# EAGLE design Adafruit Perma Proto Bonnet (EAGLE 6.6.0)
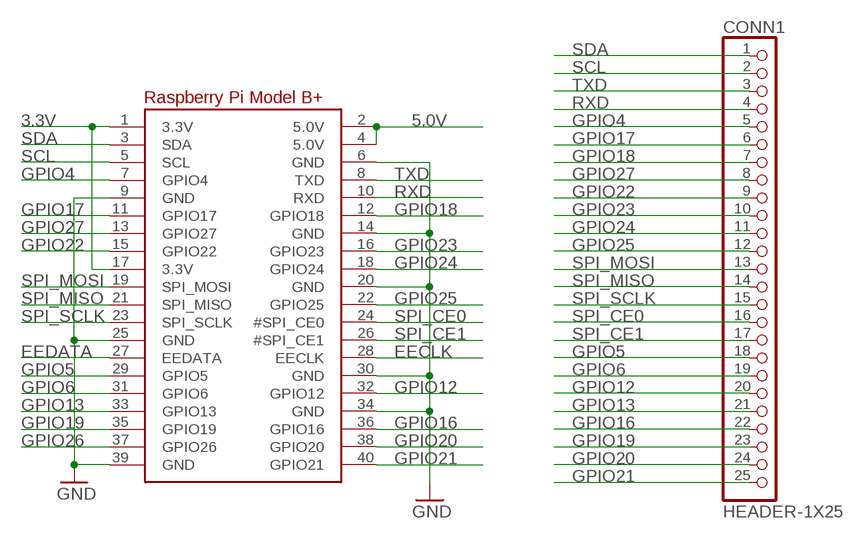
[diagram p0: schematic, sheet 1]

## Parts
CONN1  HEADER-1X25  [1X25_ROUND_70MIL]
RPI1  RASPBERRYPI_BPLUS_BONNETNODIM  [PI_BONNET_NODIM]

## Nets
3.3V: RPI1.1(3.3V) RPI1.17(3.3V)
5.0V: RPI1.2(5.0V) RPI1.4(5.0V)
EECLK: RPI1.28(EECLK)
EEDATA: RPI1.27(EEDATA)
GND: RPI1.6(GND) RPI1.9(GND) RPI1.14(GND) RPI1.20(GND) RPI1.25(GND) RPI1.30(GND) RPI1.34(GND) RPI1.39(GND)
GPIO4: CONN1.5 RPI1.7(GPIO4)
GPIO5: CONN1.18 RPI1.29(GPIO5)
GPIO6: CONN1.19 RPI1.31(GPIO6)
GPIO12: CONN1.20 RPI1.32(GPIO12)
GPIO13: CONN1.21 RPI1.33(GPIO13)
GPIO16: CONN1.22 RPI1.36(GPIO16)
GPIO17: CONN1.6 RPI1.11(GPIO17)
GPIO18: CONN1.7 RPI1.12(GPIO18)
GPIO19: CONN1.23 RPI1.35(GPIO19)
GPIO20: CONN1.24 RPI1.38(GPIO20)
GPIO21: CONN1.25 RPI1.40(GPIO21)
GPIO22: CONN1.9 RPI1.15(GPIO22)
GPIO23: CONN1.10 RPI1.16(GPIO23)
GPIO24: CONN1.11 RPI1.18(GPIO24)
GPIO25: CONN1.12 RPI1.22(GPIO25)
GPIO26: RPI1.37(GPIO26)
GPIO27: CONN1.8 RPI1.13(GPIO27)
RXD: CONN1.4 RPI1.10(RXD)
SCL: CONN1.2 RPI1.5(SCL)
SDA: CONN1.1 RPI1.3(SDA)
SPI_CE0: CONN1.16 RPI1.24(#SPI_CE0)
SPI_CE1: CONN1.17 RPI1.26(#SPI_CE1)
SPI_MISO: CONN1.14 RPI1.21(SPI_MISO)
SPI_MOSI: CONN1.13 RPI1.19(SPI_MOSI)
SPI_SCLK: CONN1.15 RPI1.23(SPI_SCLK)
TXD: CONN1.3 RPI1.8(TXD)

## Library data of the parts
CONN1 = microbuilder:HEADER-1X25
RPI1 = microbuilder:RASPBERRYPI_BPLUS

## Board
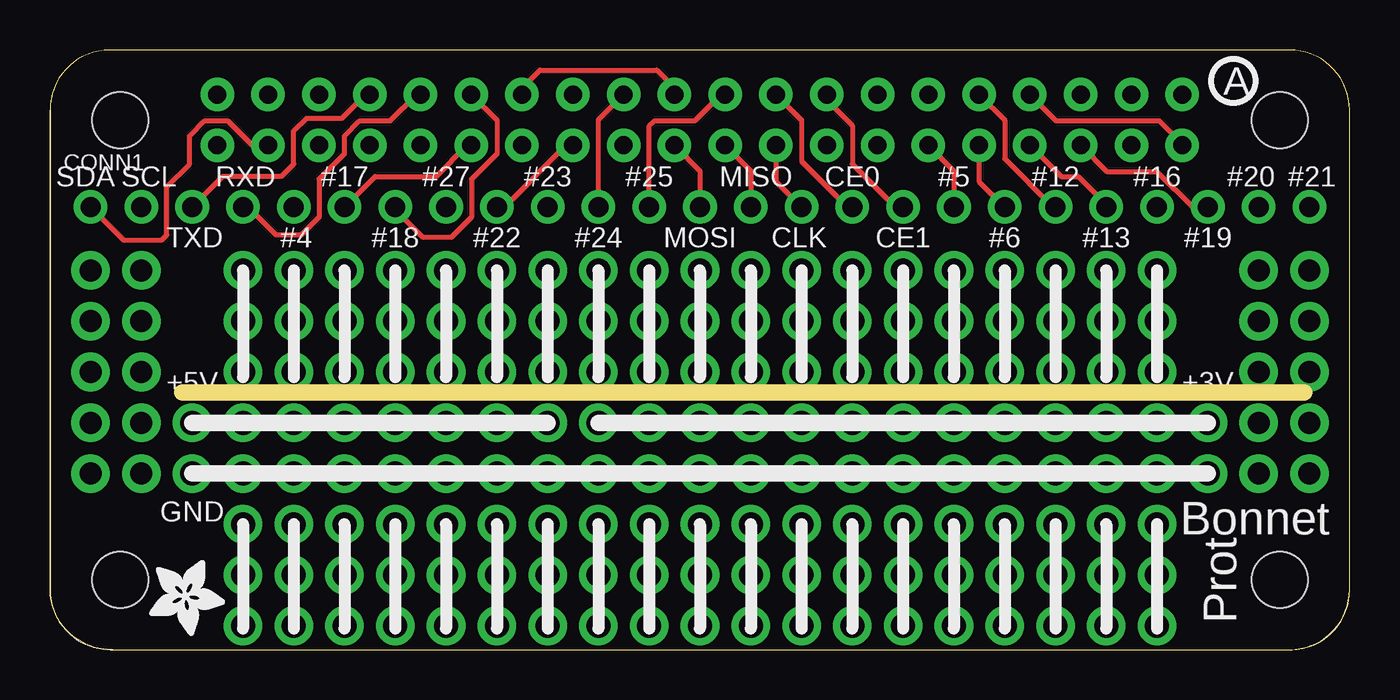
[diagram p1: board, top side]
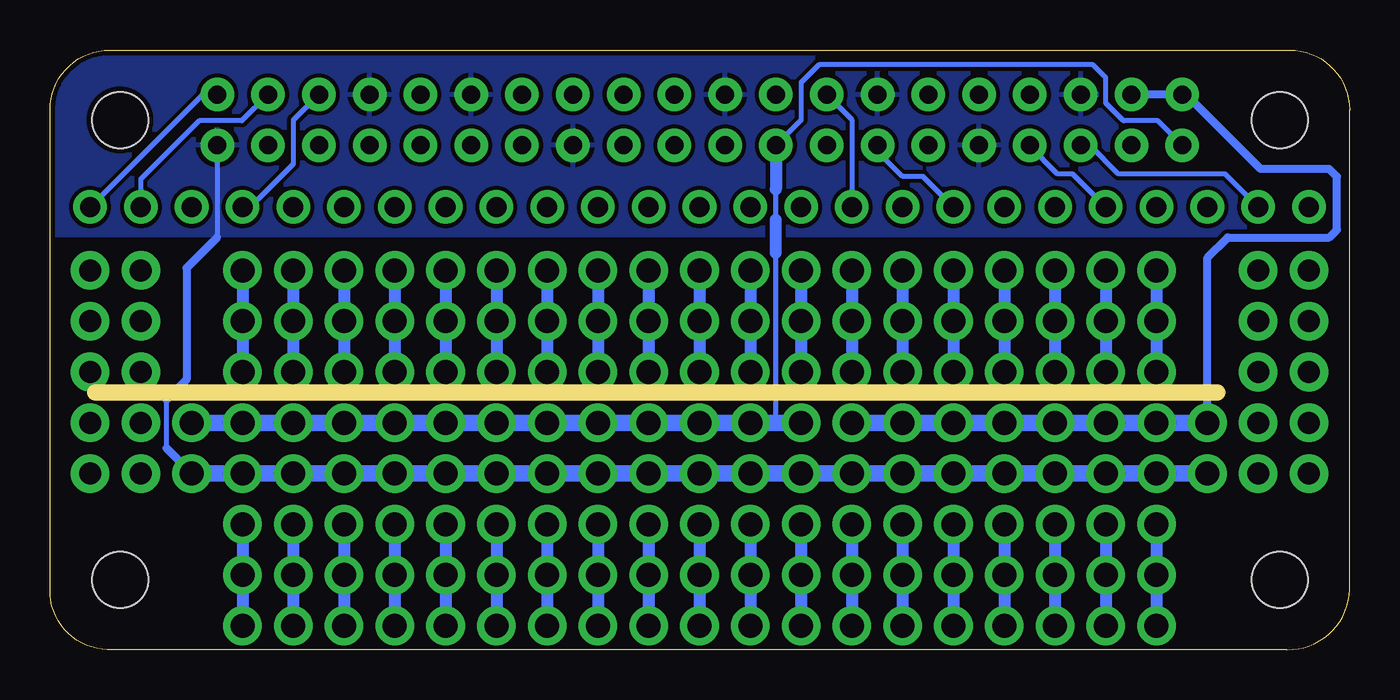
[diagram p2: board, bottom side, seen from below]

Size 65 x 30 mm. Coordinates in mm from the lower left corner, seen from the top.
Outline: 0,11 0,27 arc-90 3,30 62,30 arc-90 65,27 65,3 arc-90 62.13,0 3.13,0 arc-90 0,3 0,18.5
Copper layers (1*16): Top 0.035mm / dielectric 1.5mm / Bottom 0.035mm
Design rules "adafruit 7-7": minimum track width 6mil, minimum drill 15.5mil, track to track 8mil, track to pad 7mil, pad to pad 7mil, via to via 7mil, smd to smd 7mil, copper to edge 10mil, drill to drill 8mil, minimum pad ring 10mil, minimum via ring 8mil, stop-mask expansion 2mil, vias tented up to drill 20mil, thermal gap 10mil
Milling: 1 lines

### Footprints (pad centres in the part's own frame; a part is rotated, then mirrored left to right if it is on the bottom)
1X25_ROUND_70MIL = drill 1 pad 1.676: 1 -30.48,0; 2 -27.94,0; 3 -25.4,0; 4 -22.86,0; 5 -20.32,0; 6 -17.78,0; 7 -15.24,0; 8 -12.7,0; 9 -10.16,0; 10 -7.62,0; 11 -5.08,0; 12 -2.54,0; 13 0,0; 14 2.54,0; 15 5.08,0; 16 7.62,0; 17 10.16,0; 18 12.7,0; 19 15.24,0; 20 17.78,0; 21 20.32,0; 22 22.86,0; 23 25.4,0; 24 27.94,0; 25 30.48,0
PI_BONNET_NODIM = drill 0.9 pad 1.676: 1 8.37,25.23; 2 8.37,27.77; 3 10.91,25.23; 4 10.91,27.77; 5 13.45,25.23; 6 13.45,27.77; 7 15.99,25.23; 8 15.99,27.77; 9 18.53,25.23; 10 18.53,27.77; 11 21.07,25.23; 12 21.07,27.77; 13 23.61,25.23; 14 23.61,27.77; 15 26.15,25.23; 16 26.15,27.77; 17 28.69,25.23; 18 28.69,27.77; 19 31.23,25.23; 20 31.23,27.77; 21 33.77,25.23; 22 33.77,27.77; 23 36.31,25.23; 24 36.31,27.77; 25 38.85,25.23; 26 38.85,27.77; 27 41.39,25.23; 28 41.39,27.77; 29 43.93,25.23; 30 43.93,27.77; 31 46.47,25.23; 32 46.47,27.77; 33 49.01,25.23; 34 49.01,27.77; 35 51.55,25.23; 36 51.55,27.77; 37 54.09,25.23; 38 54.09,27.77; 39 56.63,25.23; 40 56.63,27.77 | hole 2.8: 3.5,3.5; 3.5,26.5; 61.5,26.5; 61.5,3.5

### Placement (x,y rotation side)
CONN1  32.51,22.14 0 top
RPI1  0,0 0 top
U$1  [ADAFRUIT_3.5MM]  4.95,4.49 270 top
U$3  [PCBFEAT-REV-056]  59.18,28.45 0 top

### Tracks (layer width: path | path; a pad name or v marks a point on that pad's centre or on a via)
3.3V  (via drill 1.2 pad 1.93)
  Bottom 0.254: RPI1.1 9.6,26.46 11.3,26.46 12.19,27.35 12.19,28.62 12.83,29.25 26.54,29.25 27.43,28.36 27.43,26.49 RPI1.17 | 28.7,23.03 28.7,21.51 | 28.7,19.86 28.7,11.47 28.83,11.35
  Bottom 0.61: RPI1.17 28.69,23.04 28.7,23.03 | 28.7,21.51 28.7,19.86
  Bottom 0.813: v27.43,11.35 28.83,11.35 v29.97,11.35 v32.51,11.35 v35.05,11.35 v37.59,11.35 v40.13,11.35 v42.67,11.35 v45.21,11.35 v47.75,11.35 v50.29,11.35 v52.83,11.35 v55.37,11.35 v57.91,11.35
5.0V  (via drill 1.2 pad 1.93)
  Bottom 0.406: v7.11,11.35 7.11,19.6 6.1,20.62 1.02,20.62 0.64,21 0.64,23.67 1.02,24.05 4.45,24.05 8.17,27.77 RPI1.2 RPI1.4
  Bottom 0.813: v7.11,11.35 v9.65,11.35 v12.19,11.35 v14.73,11.35 v17.27,11.35 v19.81,11.35 v22.35,11.35 v24.89,11.35
A1  (via drill 1.2 pad 1.93)
  Bottom 0.61: v9.65,13.89 v9.65,16.43 v9.65,18.97
A2  (via drill 1.2 pad 1.93)
  Bottom 0.61: v12.19,13.89 v12.19,16.43 v12.19,18.97
A3  (via drill 1.2 pad 1.93)
  Bottom 0.61: v14.73,13.89 v14.73,16.43 v14.73,18.97
A4  (via drill 1.2 pad 1.93)
  Bottom 0.61: v17.27,18.97 v17.27,16.43 v17.27,13.89
A5  (via drill 1.2 pad 1.93)
  Bottom 0.61: v19.81,13.89 v19.81,16.43 v19.81,18.97
A6  (via drill 1.2 pad 1.93)
  Bottom 0.61: v22.35,18.97 v22.35,16.43 v22.35,13.89
A7  (via drill 1.2 pad 1.93)
  Bottom 0.61: v24.89,13.89 v24.89,16.43 v24.89,18.97
A8  (via drill 1.2 pad 1.93)
  Bottom 0.61: v27.43,18.97 v27.43,16.43 v27.43,13.89
A9  (via drill 1.2 pad 1.93)
  Bottom 0.61: v29.97,13.89 v29.97,16.43 v29.97,18.97
A10  (via drill 1.2 pad 1.93)
  Bottom 0.61: v32.51,13.89 v32.51,16.43 v32.51,18.97
A11  (via drill 1.2 pad 1.93)
  Bottom 0.61: v35.05,18.97 v35.05,16.43 v35.05,13.89
A12  (via drill 1.2 pad 1.93)
  Bottom 0.61: v37.59,13.89 v37.59,16.43 v37.59,18.97
A13  (via drill 1.2 pad 1.93)
  Bottom 0.61: v40.13,18.97 v40.13,16.43 v40.13,13.89
A14  (via drill 1.2 pad 1.93)
  Bottom 0.61: v42.67,13.89 v42.67,16.43 v42.67,18.97
A15  (via drill 1.2 pad 1.93)
  Bottom 0.61: v45.21,13.89 v45.21,16.43 v45.21,18.97
A16  (via drill 1.2 pad 1.93)
  Bottom 0.61: v47.75,13.89 v47.75,16.43 v47.75,18.97
A17  (via drill 1.2 pad 1.93)
  Bottom 0.61: v50.29,13.89 v50.29,16.43 v50.29,18.97
A18  (via drill 1.2 pad 1.93)
  Bottom 0.61: v52.83,18.97 v52.83,16.43 v52.83,13.89
A19  (via drill 1.2 pad 1.93)
  Bottom 0.61: v55.37,13.89 v55.37,16.43 v55.37,18.97
B1  (via drill 1.2 pad 1.93)
  Bottom 0.61: v9.65,6.27 v9.65,3.73 v9.65,1.19
B2  (via drill 1.2 pad 1.93)
  Bottom 0.61: v12.19,1.19 v12.19,3.73 v12.19,6.27
B3  (via drill 1.2 pad 1.93)
  Bottom 0.61: v14.73,6.27 v14.73,3.73 v14.73,1.19
B4  (via drill 1.2 pad 1.93)
  Bottom 0.61: v17.27,6.27 v17.27,3.73 v17.27,1.19
B5  (via drill 1.2 pad 1.93)
  Bottom 0.61: v19.81,1.19 v19.81,3.73 v19.81,6.27
B6  (via drill 1.2 pad 1.93)
  Bottom 0.61: v22.35,6.27 v22.35,3.73 v22.35,1.19
B7  (via drill 1.2 pad 1.93)
  Bottom 0.61: v24.89,1.19 v24.89,3.73 v24.89,6.27
B8  (via drill 1.2 pad 1.93)
  Bottom 0.61: v27.43,6.27 v27.43,3.73 v27.43,1.19
B9  (via drill 1.2 pad 1.93)
  Bottom 0.61: v29.97,1.19 v29.97,3.73 v29.97,6.27
B10  (via drill 1.2 pad 1.93)
  Bottom 0.61: v32.51,6.27 v32.51,3.73 v32.51,1.19
B11  (via drill 1.2 pad 1.93)
  Bottom 0.61: v35.05,6.27 v35.05,3.73 v35.05,1.19
B12  (via drill 1.2 pad 1.93)
  Bottom 0.61: v37.59,1.19 v37.59,3.73 v37.59,6.27
B13  (via drill 1.2 pad 1.93)
  Bottom 0.61: v40.13,6.27 v40.13,3.73 v40.13,1.19
B14  (via drill 1.2 pad 1.93)
  Bottom 0.61: v42.67,1.19 v42.67,3.73 v42.67,6.27
B15  (via drill 1.2 pad 1.93)
  Bottom 0.61: v45.21,6.27 v45.21,3.73 v45.21,1.19
B16  (via drill 1.2 pad 1.93)
  Bottom 0.61: v47.75,6.27 v47.75,3.73 v47.75,1.19
B17  (via drill 1.2 pad 1.93)
  Bottom 0.61: v50.29,1.19 v50.29,3.73 v50.29,6.27
B18  (via drill 1.2 pad 1.93)
  Bottom 0.61: v52.83,6.27 v52.83,3.73 v52.83,1.19
B19  (via drill 1.2 pad 1.93)
  Bottom 0.61: v55.37,1.19 v55.37,3.73 v55.37,6.27
GND  (via drill 1.2 pad 1.93)
  Top 0.254: RPI1.34 50.32,26.46 55.5,26.46 56.63,25.33 RPI1.39 | RPI1.14 23.61,28.1 24.51,29 30.35,29 31.23,28.12 RPI1.20
  Bottom 0.254: RPI1.39 56.64,25.22 56.64,20.62 | 59.18,12.49 59.18,10.08
  Bottom 0.406: 56.64,20.62 58.17,19.09 58.17,13.51 59.18,12.49 | 59.18,10.08 v57.91,8.81
  Bottom 0.813: v57.91,8.81 v55.37,8.81 v52.83,8.81 v50.29,8.81 v47.75,8.81 v45.21,8.81 v42.67,8.81 v40.13,8.81 v37.59,8.81 v35.05,8.81 v32.51,8.81 v29.97,8.81 v27.43,8.81 v24.89,8.81 v22.35,8.81 v19.81,8.81 v17.27,8.81 v14.73,8.81 v12.19,8.81 v9.65,8.81 v7.11,8.81
  pour Bottom: 0,30.02 0,20.74 65.02,20.74 65.15,30.02
GPIO4
  Bottom 0.254: CONN1.5 13.84,23.79 14.61,23.79 15.99,25.18 RPI1.7
GPIO5
  Top 0.254: RPI1.29 45.21,23.95 CONN1.18
GPIO6
  Top 0.254: RPI1.31 46.47,23.42 CONN1.19
GPIO12
  Top 0.254: RPI1.32 47.75,26.49 47.75,24.55 50.16,22.14 CONN1.20
GPIO13
  Top 0.254: RPI1.33 50.58,23.67 51.44,23.67 52.83,22.27 CONN1.21
GPIO16
  Bottom 0.254: RPI1.36 52.83,26.49 52.83,24.3 54.99,22.14 CONN1.22
GPIO17
  Top 0.254: CONN1.6 16.26,23.67 19.3,23.67 20.87,25.23 RPI1.11
GPIO18
  Top 0.254: RPI1.12 22.35,26.49 22.35,24.81 21.08,23.54 21.08,21.63 20.07,20.62 18.67,20.62 17.27,22.01 CONN1.7
GPIO19
  Top 0.254: RPI1.35 52.86,23.92 55.37,23.92 57.15,22.14 CONN1.23
GPIO20
  Bottom 0.254: RPI1.38 55.4,26.46 57.53,26.46 60.45,23.54 CONN1.24
GPIO21
  Bottom 0.254: RPI1.40 57.36,27.77 CONN1.25
GPIO22
  Top 0.254: CONN1.9 22.73,22.14 25.82,25.23 RPI1.15
GPIO23
  Bottom 0.254: RPI1.16 24.89,26.51 CONN1.10
GPIO24
  Top 0.254: CONN1.11 27.43,26.51 RPI1.18
GPIO25
  Top 0.254: CONN1.12 29.97,26.21 30.23,26.46 32.26,26.46 33.57,27.77 RPI1.22
GPIO27
  Bottom 0.254: CONN1.8 21.34,23.67 22.35,23.67 23.61,24.92 RPI1.13
N$22  (via drill 1.1 pad 1.93)
  other vias: 4.57,18.97
N$23  (via drill 1.1 pad 1.93)
  other vias: 2.03,18.97
N$24  (via drill 1.1 pad 1.93)
  other vias: 2.03,16.43
N$25  (via drill 1.1 pad 1.93)
  other vias: 4.57,16.43
N$26  (via drill 1.1 pad 1.93)
  other vias: 4.57,13.89
N$27  (via drill 1.1 pad 1.93)
  other vias: 2.03,13.89
N$28  (via drill 1.1 pad 1.93)
  other vias: 2.03,11.35
N$29  (via drill 1.1 pad 1.93)
  other vias: 4.57,11.35
N$30  (via drill 1.1 pad 1.93)
  other vias: 4.57,8.81
N$31  (via drill 1.1 pad 1.93)
  other vias: 2.03,8.81
N$32  (via drill 1.1 pad 1.93)
  other vias: 62.99,18.97
N$33  (via drill 1.1 pad 1.93)
  other vias: 60.45,18.97
N$34  (via drill 1.1 pad 1.93)
  other vias: 60.45,16.43
N$35  (via drill 1.1 pad 1.93)
  other vias: 62.99,16.43
N$36  (via drill 1.1 pad 1.93)
  other vias: 62.99,13.89
N$37  (via drill 1.1 pad 1.93)
  other vias: 60.45,13.89
N$38  (via drill 1.1 pad 1.93)
  other vias: 60.45,11.35
N$39  (via drill 1.1 pad 1.93)
  other vias: 62.99,11.35
N$40  (via drill 1.1 pad 1.93)
  other vias: 62.99,8.81
N$41  (via drill 1.1 pad 1.93)
  other vias: 60.45,8.81
RXD
  Top 0.254: RPI1.10 18.33,27.77 17.02,26.46 15.49,26.46 14.73,25.7 14.73,24.81 13.46,23.54 13.46,21.63 12.57,20.74 11.3,20.74 9.91,22.14 CONN1.4
SCL
  Bottom 0.254: CONN1.2 6.22,23.79 11.56,23.79 12.99,25.23 RPI1.5
SDA
  Top 0.254: CONN1.1 3.68,20.49 5.59,20.49 5.84,20.74 5.84,23.16 6.99,24.3 6.99,25.7 7.75,26.46 8.89,26.46 10.12,25.23 RPI1.3
SPI_CE0
  Top 0.254: RPI1.24 37.59,26.49 37.59,24.43 39.88,22.14 CONN1.16
SPI_CE1
  Top 0.254: RPI1.26 38.85,27.49 40.13,26.21 40.13,24.3 42.29,22.14 CONN1.17
SPI_MISO
  Top 0.254: RPI1.21 35.05,23.95 CONN1.14
SPI_MOSI
  Top 0.254: RPI1.19 32.51,23.95 CONN1.13
SPI_SCLK
  Top 0.254: RPI1.23 36.31,23.42 CONN1.15
TXD
  Top 0.254: RPI1.8 15.79,27.77 14.61,26.59 12.83,26.59 12.19,25.95 12.19,24.3 11.56,23.67 8.64,23.67 CONN1.3

### Text on the board
tPlace: SDA | SCL | RXD | #17 | #27 | #23 | #25 | MISO | CE0 | #5 | #12 | #16 | #20 | #21 | TXD | #4 | #18 | #22 | #24 | MOSI | CLK | CE1 | #6 | #13 | #19 | Bonnet | Prot
tPlaceBlue: GND
tPlaceRed: +5V | +3V